# EAGLE design ESP8266_ESP-01_Breakout (EAGLE 7.4.0)
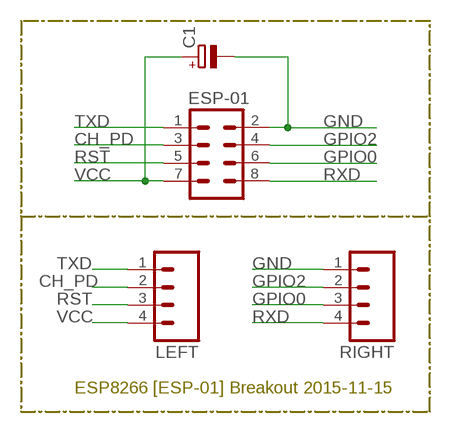
[diagram p0: schematic, sheet 1]

## Parts
C1  CPOL-EUB45181B  [B45181B]
ESP-01  M04X2  [2X4]
LEFT  M04PTH  [1X04]
RIGHT  M04PTH  [1X04]

## Nets
CH_PD: ESP-01.3 LEFT.2
GND: C1.- ESP-01.2 RIGHT.1
GPIO0: ESP-01.6 RIGHT.3
GPIO2: ESP-01.4 RIGHT.2
RST: ESP-01.5 LEFT.3
RXD: ESP-01.8 RIGHT.4
TXD: ESP-01.1 LEFT.1
VCC: C1.+ ESP-01.7 LEFT.4

## Notes on the sheet
- ESP8266 [ESP-01] Breakout 2015-11-15

## Library data of the parts
C1 = rcl:CPOL-EU: POLARIZED CAPACITOR, European symbol
ESP-01 = SparkFun-Connectors:M04X2: .1" header, two rows of four.
LEFT RIGHT = SparkFun-Connectors:M04: Header 4 Standard 4-pin 0.1" header. Use with straight break away headers (SKU : PRT-00116), right angle break away headers (PRT-00553), swiss pins (PRT-00743), machine pins (PRT-00117), and female headers (PRT-00115). Molex polarized connector foot print use with SKU : PRT-08231 with associated crimp pins and housings. 1MM SMD Version SKU: PRT-10208

## Board
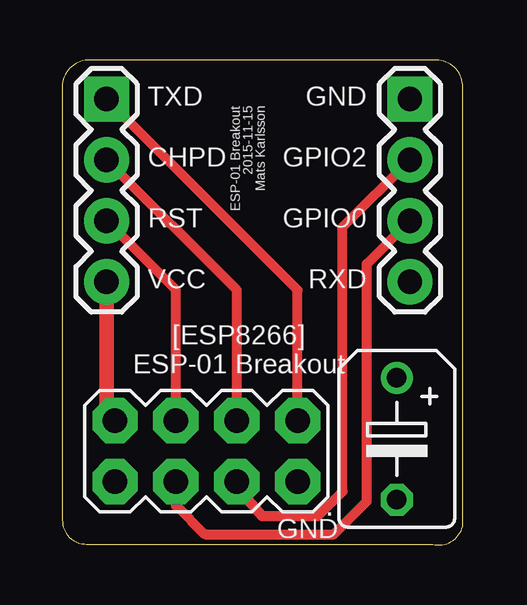
[diagram p1: board, top side]
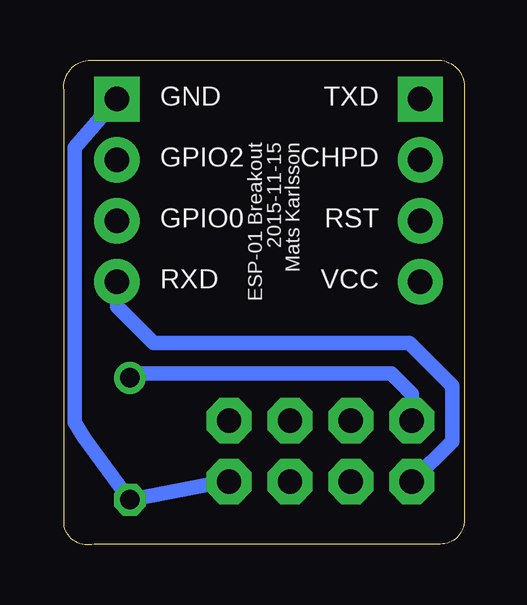
[diagram p2: board, bottom side, seen from below]

Size 16.7 x 20.23 mm. Coordinates in mm from the lower left corner, seen from the top.
Outline: 0,19.22 0,1.03 arc90 1,0.03 15.44,0.03 arc90 16.7,0.78 16.7,18.96 arc90 15.7,20.22 1.25,20.22 arc90 0,19.22
Copper layers (1*16): Top 0.035mm / dielectric 1.5mm / Bottom 0.035mm
Design rules "Elecrow_2-layer_eagle_rule": minimum track width 6mil, minimum drill 12mil, track to track 6mil, track to pad 6mil, pad to pad 6mil, via to via 6mil, smd to smd 0mil, copper to edge 10mil, drill to drill 10mil, minimum pad ring 10mil, minimum via ring 6mil, stop-mask expansion 2mil, vias tented up to drill 100mil, thermal gap 10mil

### Footprints (pad centres in the part's own frame; a part is rotated, then mirrored left to right if it is on the bottom)
B45181B = drill 0.813: + -2.54,0 | drill 0.813 octagon: - 2.54,0
2X4 = drill 1.016 pad 1.88 octagon: 1 -3.81,-1.27; 2 -3.81,1.27; 3 -1.27,-1.27; 4 -1.27,1.27; 5 1.27,-1.27; 6 1.27,1.27; 7 3.81,-1.27; 8 3.81,1.27
1X04 = drill 1.016 pad 1.88 square: 1 0,0 | drill 1.016 pad 1.88: 2 2.54,0; 3 5.08,0; 4 7.62,0

### Placement (x,y rotation side)
C1  13.95,4.43 270 top
ESP-01  6,3.91 180 top
LEFT  1.84,18.6 270 top
RIGHT  14.49,18.6 270 top

### Tracks (layer width: path | path; a pad name or v marks a point on that pad's centre or on a via)
CH_PD
  Top 0.406: ESP-01.3 7.27,10.62 LEFT.2
GND
  Bottom 0.61: ESP-01.2 9.85,2.68 C1.- 15.85,4.46 16.26,5.11 16.26,16.58 RIGHT.1
GPIO0
  Top 0.406: ESP-01.6 4.73,1.65 5.94,0.45 11.34,0.45 12.7,1.81 12.7,11.73 RIGHT.3
GPIO2
  Top 0.406: 7.27,2.41 8.32,1.21 10.67,1.21 11.68,2.23 11.68,13.25 RIGHT.2
  Top 0.61: ESP-01.4 7.27,2.41
RST
  Top 0.406: ESP-01.5 4.73,10.62 LEFT.3
RXD
  Bottom 0.61: ESP-01.8 0.51,4.33 0.51,6.64 2.29,8.42 12.95,8.42 14.48,9.94 14.48,10.96 RIGHT.4
TXD
  Top 0.406: ESP-01.1 9.81,10.62 LEFT.1
VCC
  Top 0.61: LEFT.4 1.84,5.54 ESP-01.7
  Bottom 0.61: ESP-01.7 2.19,6.29 3.05,7.15 13.45,7.15 C1.+

### Text on the board
tPlace: TXD | ESP-01 Breakout / 2015-11-15 / Mats Karlsson | GND | CHPD | GPIO2 | RST | GPIO0 | VCC | RXD | [ESP8266] / ESP-01 Breakout | . | GND
bPlace: TXD | GND | ESP-01 Breakout / 2015-11-15 / Mats Karlsson | CHPD | GPIO2 | RST | GPIO0 | VCC | RXD